# Altium schematic sheet LEDs.SchDoc: LED Driver and LEDs
size Letter; Date: 2017-02-19; Revision: A; SheetNumber: 4; SheetTotal: 6; ProjectTitle: CANwheel
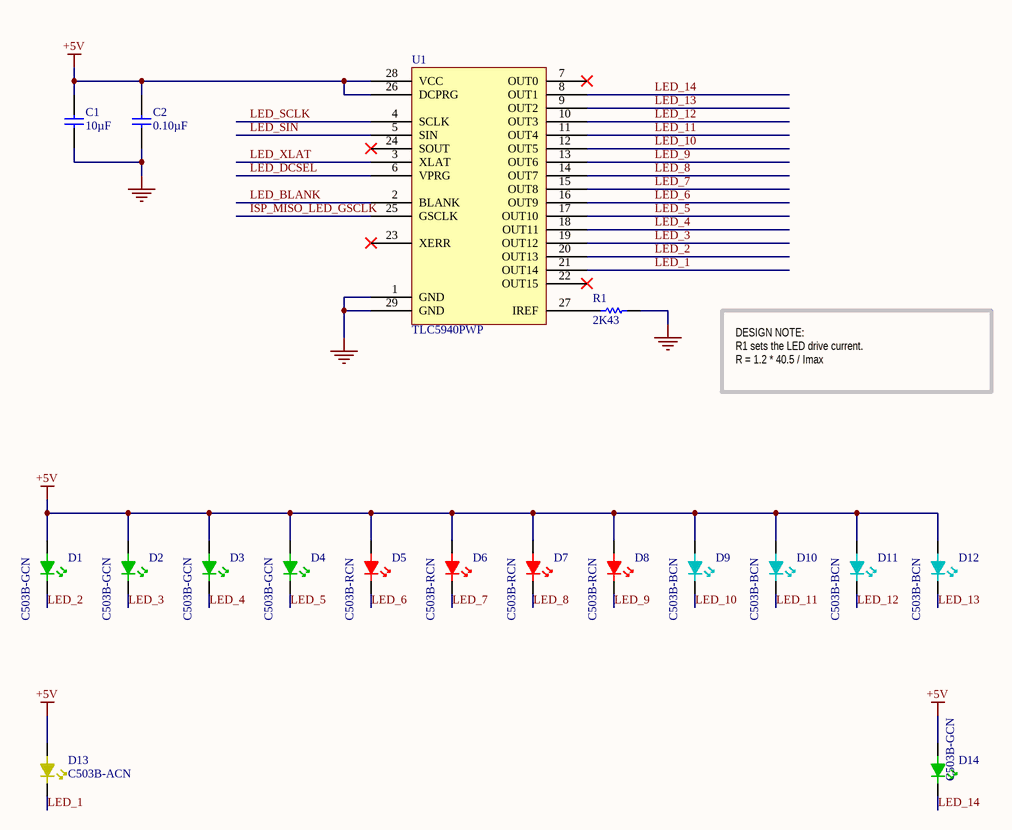
[diagram p0: LEDs.SchDoc]

## Parts
C1  value 10µF  [CAP-0805-M]  (hidden comment: CAP 10µF ±10% 6.3V 0805 X7R)
C2  value 0.10µF  [CAP-0402-M]  (hidden comment: CAP 0.10µF ±10% 6.3V 0402 X7R)
D1  C503B-GCN  [LED-5mm-G]
D2  C503B-GCN  [LED-5mm-G]
D3  C503B-GCN  [LED-5mm-G]
D4  C503B-GCN  [LED-5mm-G]
D5  C503B-RCN  [LED-5mm-R]
D6  C503B-RCN  [LED-5mm-R]
D7  C503B-RCN  [LED-5mm-R]
D8  C503B-RCN  [LED-5mm-R]
D9  C503B-BCN  [LED-5mm-B]
D10  C503B-BCN  [LED-5mm-B]
D11  C503B-BCN  [LED-5mm-B]
D12  C503B-BCN  [LED-5mm-B]
D13  C503B-ACN  [LED-5mm-A]
D14  C503B-GCN  [LED-5mm-G]
R1  value 2K43  [RES-0603-M]  (hidden comment: RES 2K43 1% 1/10 W 0603 ±100ppm/°C)
U1  TLC5940PWP  [TSOP65P640X120_HS-29N]

## Nets
+5V: C1.1 C2.1 D1.1 D2.1 D3.1 D4.1 D5.1 D6.1 D7.1 D8.1 D9.1 D10.1 D11.1 D12.1 D13.1 D14.1 U1.26(DCPRG) U1.28(VCC)
GND: C1.2 C2.2 R1.1 U1.1(GND) U1.29(GND)
ISP_MISO_LED_GSCLK: U1.25(GSCLK)
LED_1: D13.2 U1.21(OUT14)
LED_2: D1.2 U1.20(OUT13)
LED_3: D2.2 U1.19(OUT12)
LED_4: D3.2 U1.18(OUT11)
LED_5: D4.2 U1.17(OUT10)
LED_6: D5.2 U1.16(OUT9)
LED_7: D6.2 U1.15(OUT8)
LED_8: D7.2 U1.14(OUT7)
LED_9: D8.2 U1.13(OUT6)
LED_10: D9.2 U1.12(OUT5)
LED_11: D10.2 U1.11(OUT4)
LED_12: D11.2 U1.10(OUT3)
LED_13: D12.2 U1.9(OUT2)
LED_14: D14.2 U1.8(OUT1)
LED_BLANK: U1.2(BLANK)
LED_DCSEL: U1.6(VPRG)
LED_SCLK: U1.4(SCLK)
LED_SIN: U1.5(SIN)
LED_XLAT: U1.3(XLAT)
NetR1_2: R1.2 U1.27(IREF)

Not connected (* = marked no-connect by the designer): U1 7(OUT0)* 22(OUT15)* 23(XERR)* 24(SOUT)*

## Notes on the sheet
- DESIGN NOTE:
  R1 sets the LED drive current.
  R = 1.2 * 40.5 / Imax
- Date:
- Revision:
- Sheet:
- /

## Library data of the parts
C1 = CC0805KKX7R5BB106: Manufacturer: Yageo; Manufacturer Series: CC; Part Number: CC0805KKX7R5BB106; Component Type: Standard; Tolerance: ±10%; Voltage: 6.3V; Package: 0805; Temperature Coefficient: X7R; Temperature Range: -55°C ~ 125°C; Supplier 1: Digi-Key; Supplier Part Number 1: 311-1877-1-ND
C2 = CC0402KRX7R5BB104: Manufacturer: Yageo; Manufacturer Series: CC; Part Number: CC0402KRX7R5BB104; Component Type: Standard; Tolerance: ±10%; Voltage: 6.3V; Package: 0402; Temperature Coefficient: X7R; Temperature Range: -55°C ~ 125°C; Supplier 1: Digi-Key; Supplier Part Number 1: 311-1701-1-ND
R1 = RC0603FR-072K43L: Manufacturer: Yageo; Manufacturer Series: RC; Power: 1/10 W; Part Number: RC0603FR-072K43L; Component Type: Standard; Tolerance: 1%; Package: 0603; Temperature Coefficient: ±100ppm/°C; Temperature Range: -55°C ~ 155°C; Supplier 1: Digi-Key; Supplier Part Number 1: 311-2.43KHRCT-ND